# EAGLE schematic メイン回路 (EAGLE 9.6.2)
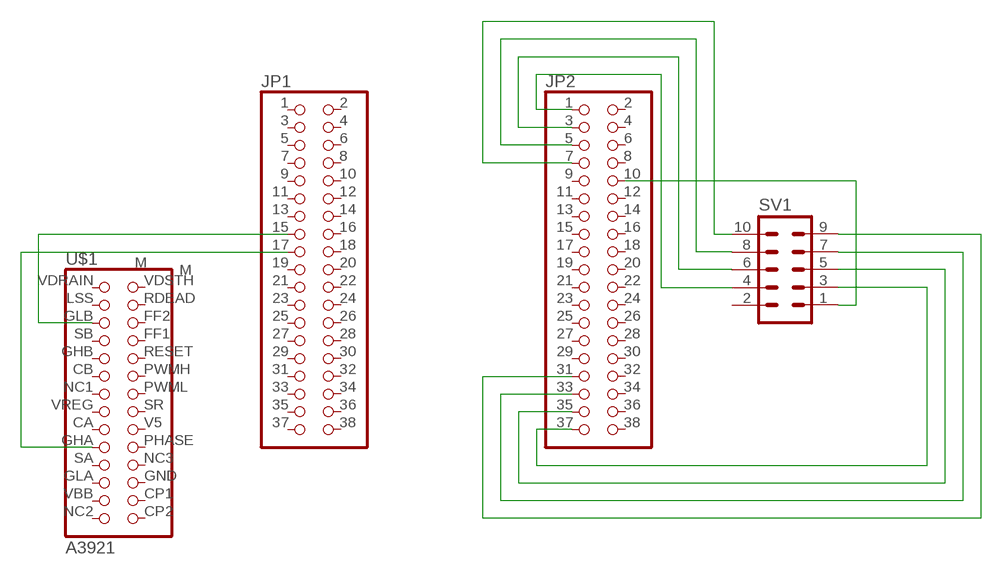
[diagram p0: schematic, sheet 1]

## Parts
JP1  PINHD-2X19  [2X19]
JP2  PINHD-2X19  [2X19]
SV1  ML10L  [ML10L]
U$1  A3921  [A3921]

## Nets
N$1: JP1.15 U$1.GLB
N$2: JP1.17 U$1.GHA
N$3: JP2.10 SV1.1
N$4: JP2.1 SV1.4
N$5: JP2.3 SV1.6
N$6: JP2.5 SV1.8
N$7: JP2.7 SV1.10
N$8: JP2.37 SV1.3
N$9: JP2.35 SV1.5
N$10: JP2.33 SV1.7
N$11: JP2.31 SV1.9
Unconnected: JP1.1 JP1.2 JP1.3 JP1.4 JP1.5 JP1.6 JP1.7 JP1.8 JP1.9 JP1.10 JP1.11 JP1.12 JP1.13 JP1.14 JP1.16 JP1.18 JP1.19 JP1.20 JP1.21 JP1.22 JP1.23 JP1.24 JP1.25 JP1.26 JP1.27 JP1.28 JP1.29 JP1.30 JP1.31 JP1.32 JP1.33 JP1.34 JP1.35 JP1.36 JP1.37 JP1.38 JP2.2 JP2.4 JP2.6 JP2.8 JP2.9 JP2.11 JP2.12 JP2.13 JP2.14 JP2.15 JP2.16 JP2.17 JP2.18 JP2.19 JP2.20 JP2.21 JP2.22 JP2.23 JP2.24 JP2.25 JP2.26 JP2.27 JP2.28 JP2.29 JP2.30 JP2.32 JP2.34 JP2.36 JP2.38 SV1.2 U$1.CA U$1.CB U$1.CP1 U$1.CP2 U$1.FF1 U$1.FF2 U$1.GHB U$1.GLA U$1.GND U$1.LSS U$1.M U$1.NC1 U$1.NC2 U$1.NC3 U$1.PHASE U$1.PWMH U$1.PWML U$1.RDEAD U$1.RESET U$1.SA U$1.SB U$1.SR U$1.V5 U$1.VBB U$1.VDRAIN U$1.VDSTH U$1.VREG

## Library data of the parts
JP1 JP2 = pinhead:PINHD-2X19: PIN HEADER
SV1 = con-ml:ML10L: HARTING; OC_FARNELL: unknown; OC_NEWARK: unknown
U$1 = A3921:A3921